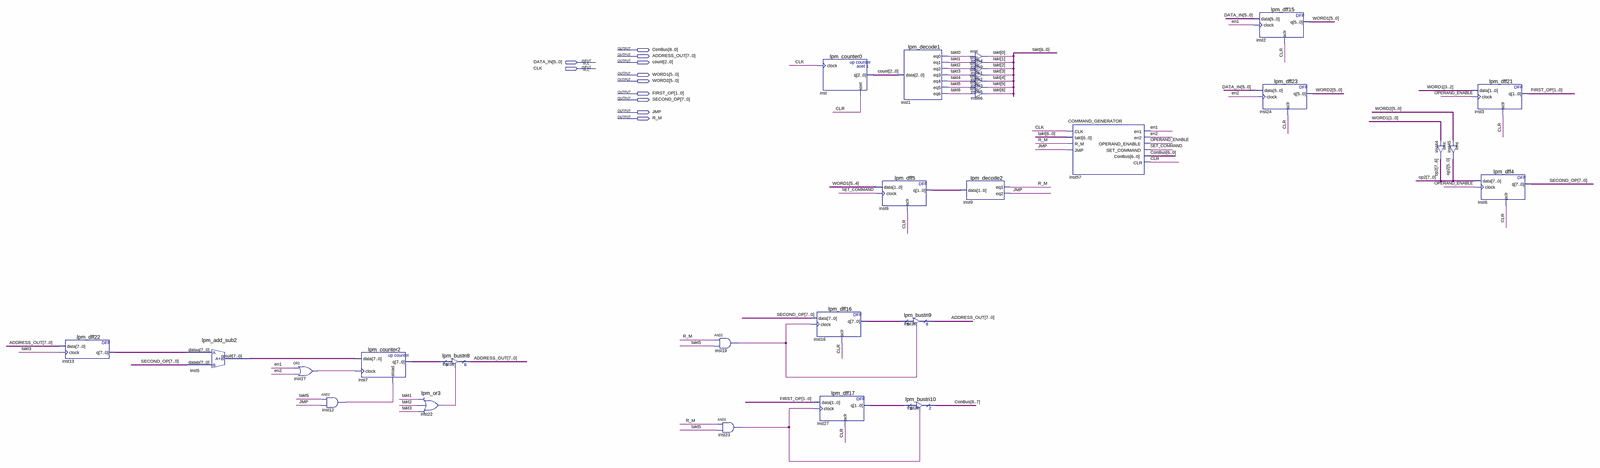
[diagram p0: schematic sheet, whole]
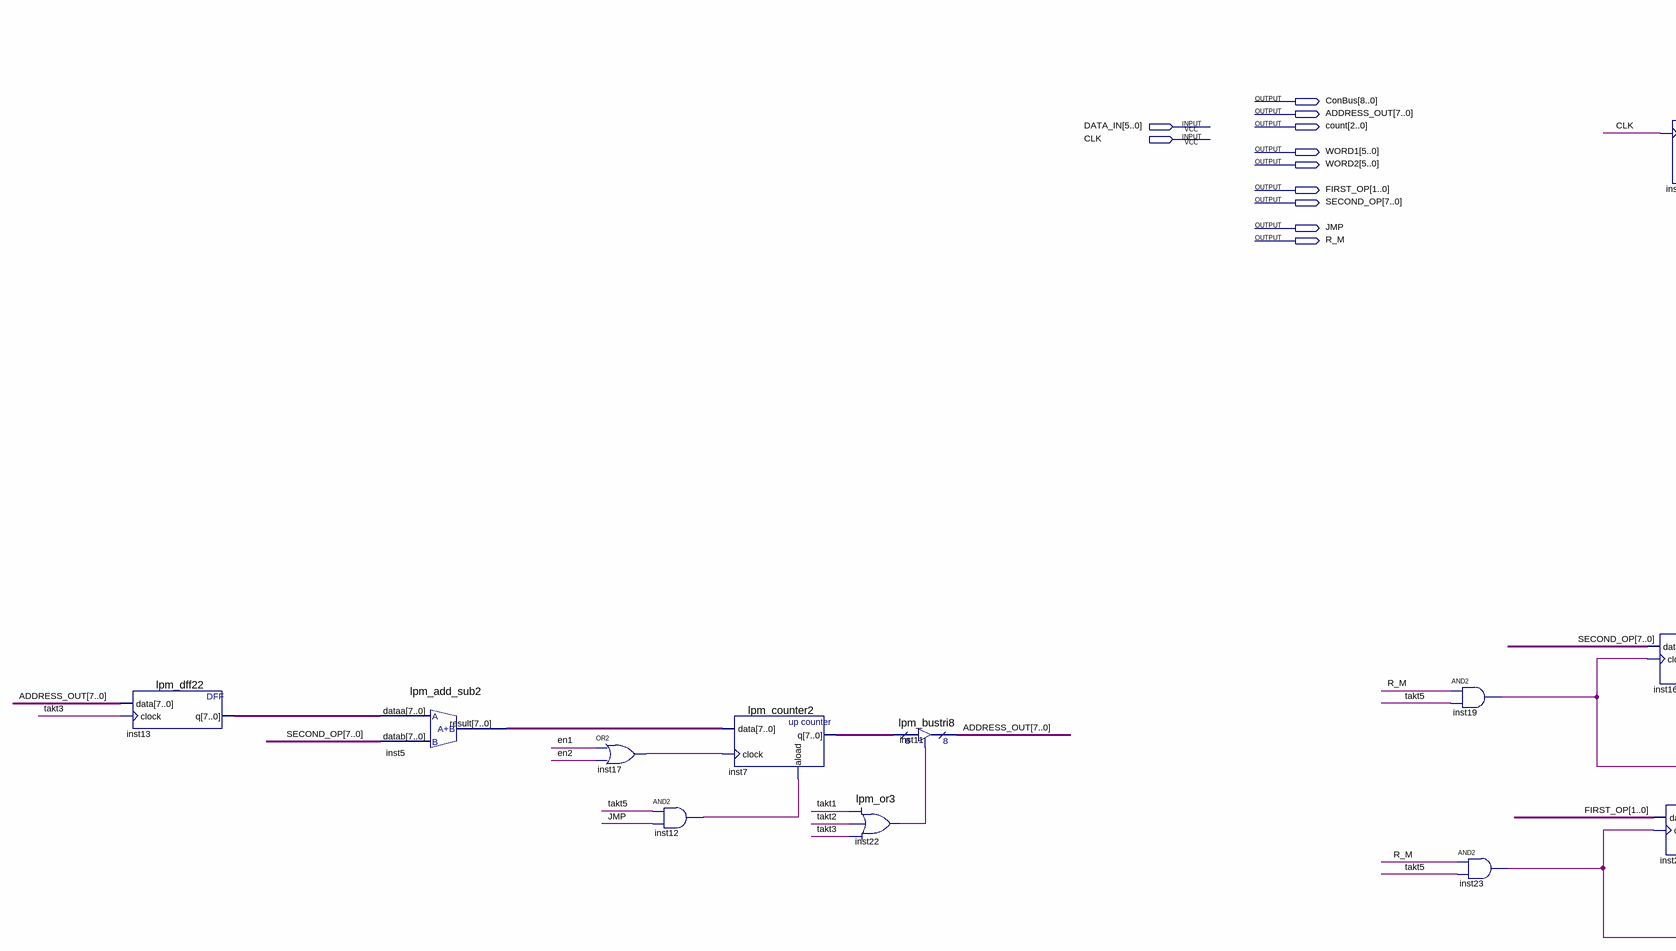
[diagram p1: schematic sheet, left part]
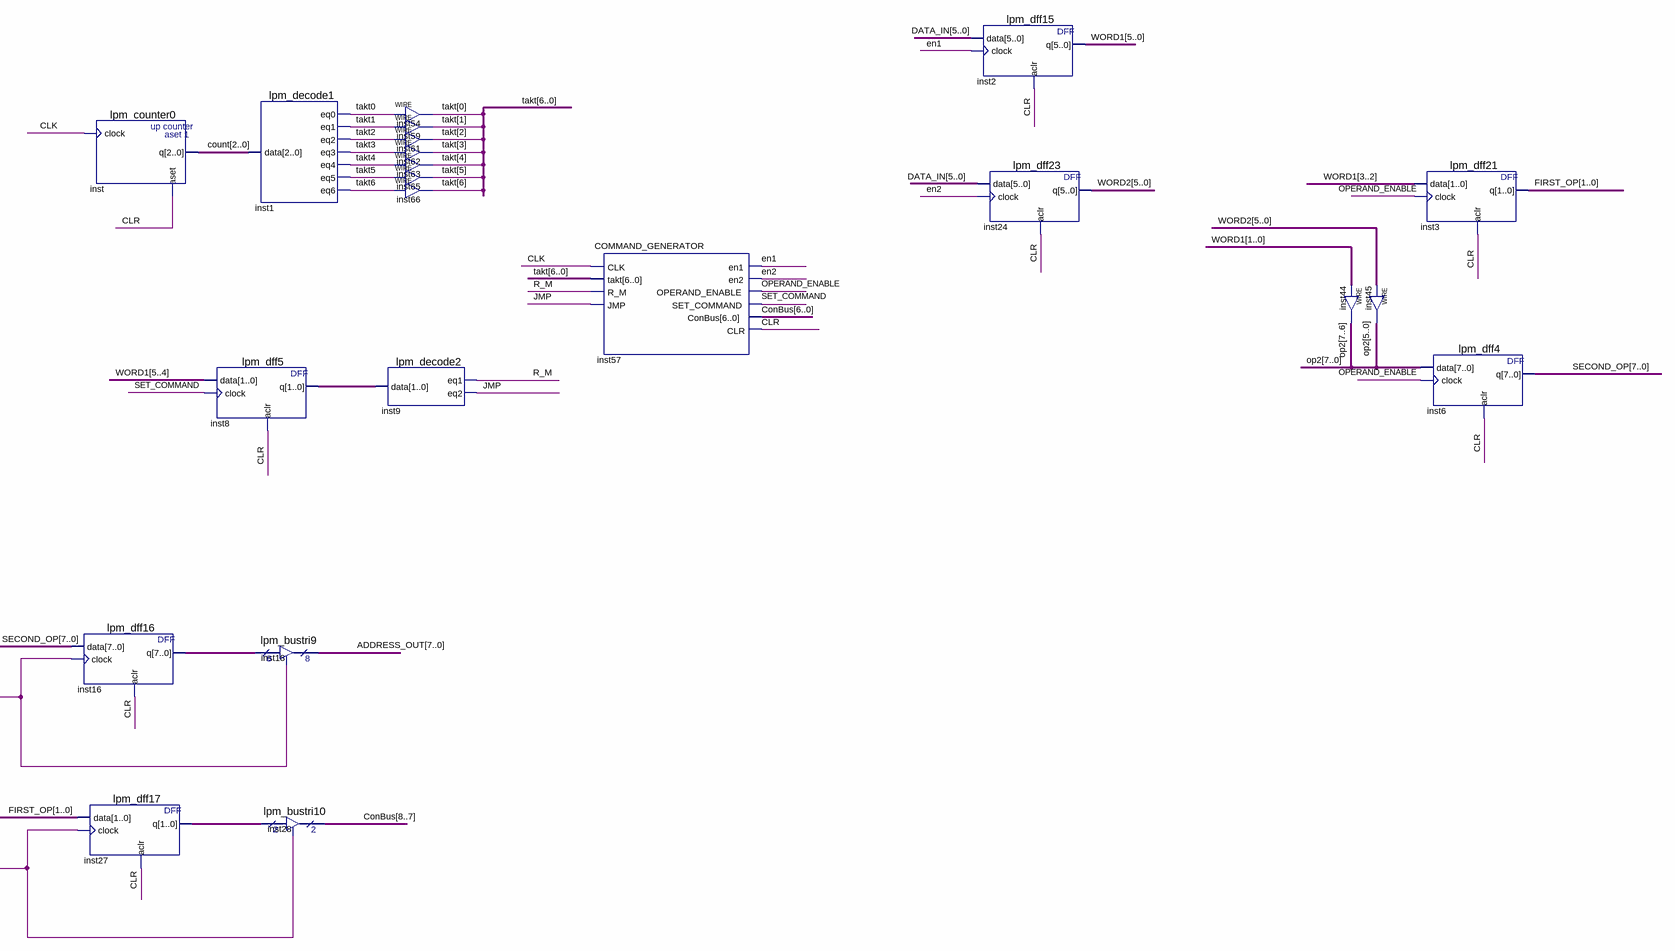
[diagram p2: schematic sheet, right part]
// Quartus schematic LOGIC.bdf as structural Verilog: 31 symbols, 11 pins
module LOGIC (
  input  [5:0] DATA_IN,
  input  CLK,
  output [8:0] ConBus,
  output [7:0] ADDRESS_OUT,
  output [2:0] count,
  output [5:0] WORD1,
  output [5:0] WORD2,
  output [1:0] FIRST_OP,
  output [7:0] SECOND_OP,
  output JMP,
  output R_M
);

  wire CLR, en1, en2, inst12_out, inst17_out, inst19_out, inst22_result, inst23_out, OPERAND_ENABLE,
       SET_COMMAND;
  wire [1:0] inst8_q, inst27_q;
  wire [6:0] takt;
  wire [7:0] inst5_result, inst7_q, inst13_q, inst16_q, op2;

  lpm_dff22 inst13 (.data(ADDRESS_OUT), .clock(takt[3]), .q(inst13_q));
  lpm_add_sub2 inst5 (.dataa(inst13_q), .datab(SECOND_OP), .result(inst5_result));
  or inst17 (inst17_out, en1, en2);
  and inst12 (inst12_out, takt[5], JMP);
  lpm_counter2 inst7 (.data(inst5_result), .clock(inst17_out), .aload(inst12_out), .q(inst7_q));
  lpm_or3 inst22 (.data0(takt[1]), .data1(takt[2]), .data2(takt[3]), .result(inst22_result));
  lpm_bustri8 inst11 (.enabledt(inst22_result), .data(inst7_q), .tridata(ADDRESS_OUT));
  and inst19 (inst19_out, R_M, takt[5]);
  and inst23 (inst23_out, R_M, takt[5]);
  lpm_counter0 inst (.clock(CLK), .aset(CLR), .q(count));
  lpm_dff16 inst16 (.data(SECOND_OP), .clock(inst19_out), .aclr(CLR), .q(inst16_q));
  lpm_dff17 inst27 (.data(FIRST_OP), .clock(inst23_out), .aclr(CLR), .q(inst27_q));
  lpm_dff5 inst8 (.data(WORD1[5:4]), .clock(SET_COMMAND), .aclr(CLR), .q(inst8_q));
  lpm_decode1 inst1 (
    .data(count), .eq0(takt[0]), .eq1(takt[1]), .eq2(takt[2]), .eq3(takt[3]), .eq4(takt[4]), .eq5(takt[5]),
    .eq6(takt[6]));
  lpm_bustri9 inst18 (.enabledt(inst19_out), .data(inst16_q), .tridata(ADDRESS_OUT));
  lpm_bustri10 inst28 (.enabledt(inst23_out), .data(inst27_q), .tridata(ConBus[8:7]));
  assign takt[0] = takt[0];  // WIRE inst54
  assign takt[1] = takt[1];  // WIRE inst59
  assign takt[2] = takt[2];  // WIRE inst61
  assign takt[3] = takt[3];  // WIRE inst62
  assign takt[4] = takt[4];  // WIRE inst63
  assign takt[5] = takt[5];  // WIRE inst65
  assign takt[6] = takt[6];  // WIRE inst66
  lpm_decode2 inst9 (.data(inst8_q), .eq1(R_M), .eq2(JMP));
  COMMAND_GENERATOR inst57 (
    .CLK(CLK), .takt(takt), .R_M(R_M), .JMP(JMP), .en1(en1), .en2(en2), .OPERAND_ENABLE(OPERAND_ENABLE),
    .SET_COMMAND(SET_COMMAND), .ConBus(ConBus[6:0]), .CLR(CLR));
  lpm_dff15 inst2 (.data(DATA_IN), .clock(en1), .aclr(CLR), .q(WORD1));
  lpm_dff23 inst24 (.data(DATA_IN), .clock(en2), .aclr(CLR), .q(WORD2));
  assign op2[7:6] = WORD1[1:0];  // WIRE inst44
  assign op2[5:0] = WORD2;  // WIRE inst45
  lpm_dff21 inst3 (.data(WORD1[3:2]), .clock(OPERAND_ENABLE), .aclr(CLR), .q(FIRST_OP));
  lpm_dff4 inst6 (.data(op2), .clock(OPERAND_ENABLE), .aclr(CLR), .q(SECOND_OP));
endmodule
